# Altium schematic sheet modFOC-H_Bridges.SchDoc: modFOC-H-Bridges
size A4; Author: Mathias Giller; CompanyName: HTL St. Pölten; Address1: modFOC; DocumentNumber: 6; Revision: 2.0; SheetNumber: 6; SheetTotal: 7
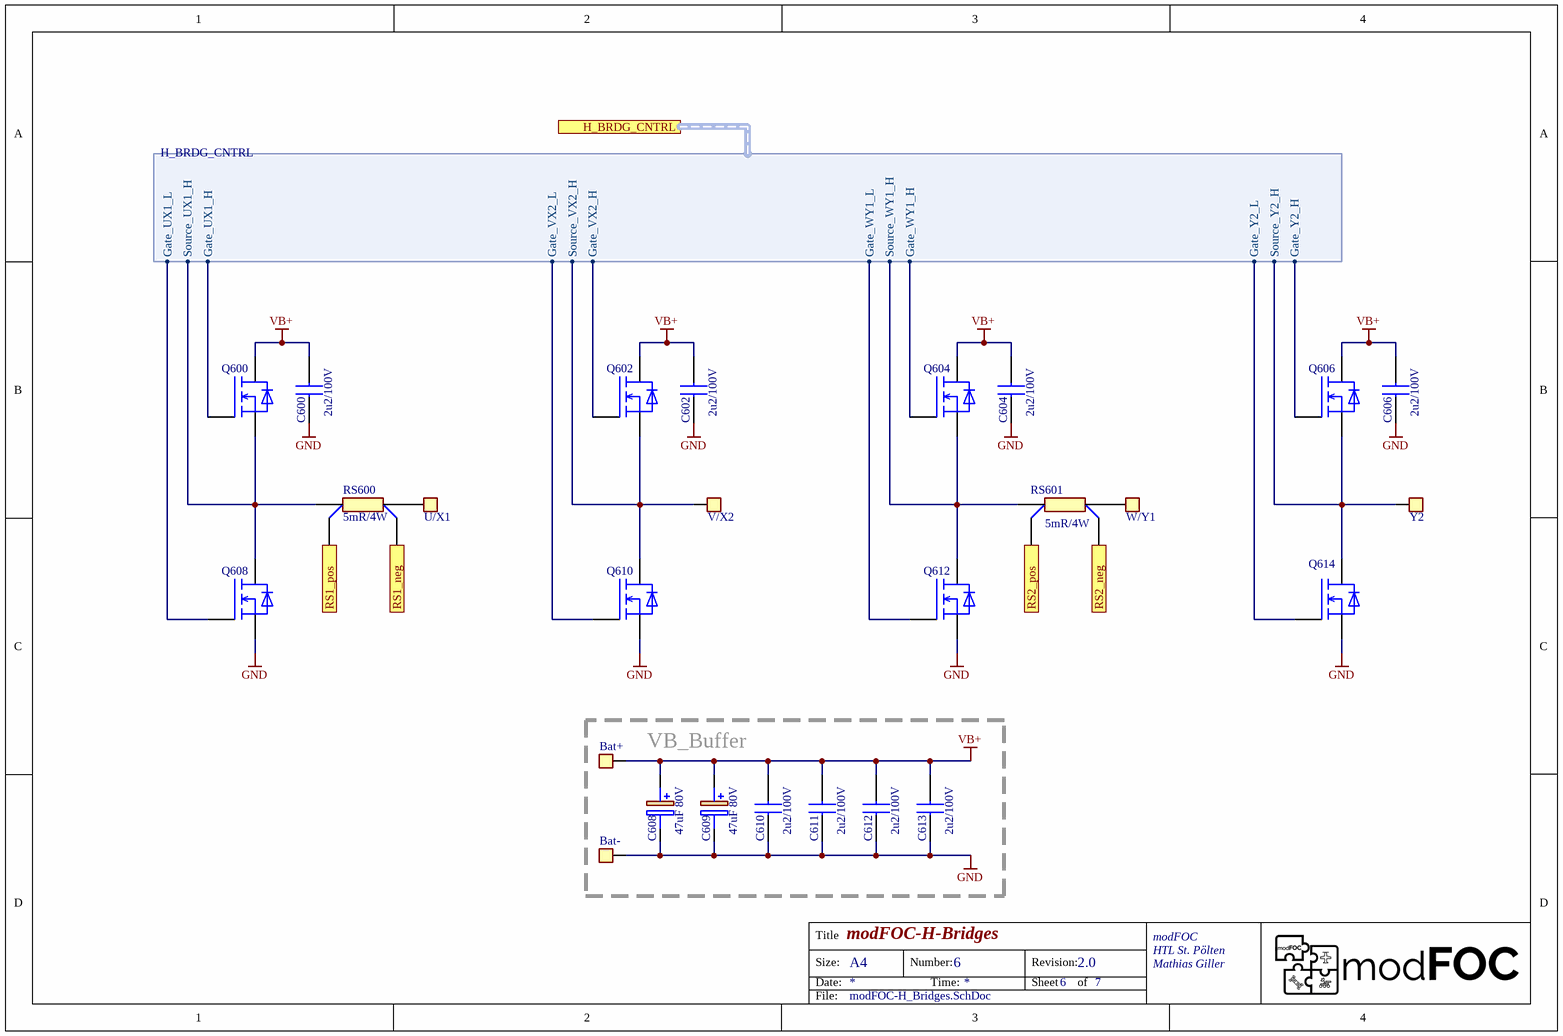
[diagram p0: modFOC-H_Bridges.SchDoc]

## Parts
Bat+  PowerPad  [POWER_PAD]  (value not drawn)
Bat-  PowerPad  [POWER_PAD]  (value not drawn)
C600  2u2/100V  [CAPC3225X280N]
C602  2u2/100V  [CAPC3225X280N]
C604  2u2/100V  [CAPC3225X280N]
C606  2u2/100V  [CAPC3225X280N]
C608  47uF 80V  [CAPAE1050X1050N]
C609  47uF 80V  [CAPAE1050X1050N]
C610  2u2/100V  [CAPC3225X280N]
C611  2u2/100V  [CAPC3225X280N]
C612  2u2/100V  [CAPC3225X280N]
C613  2u2/100V  [CAPC3225X280N]
Q600  80V/100A  [SI7141DPT1GE3]  (value not drawn)
Q602  80V/100A  [SI7141DPT1GE3]  (value not drawn)
Q604  80V/100A  [SI7141DPT1GE3]  (value not drawn)
Q606  80V/100A  [SI7141DPT1GE3]  (value not drawn)
Q608  80V/100A  [SI7141DPT1GE3]  (value not drawn)
Q610  80V/100A  [SI7141DPT1GE3]  (value not drawn)
Q612  80V/100A  [SI7141DPT1GE3]  (value not drawn)
Q614  80V/100A  [SI7141DPT1GE3]  (value not drawn)
RS600  5mR/4W  [FC4L90R025FER]
RS601  5mR/4W  [FC4L90R025FER]
U/X1  PowerPad  [POWER_PAD]  (value not drawn)
V/X2  PowerPad  [POWER_PAD]  (value not drawn)
W/Y1  PowerPad  [POWER_PAD]  (value not drawn)
Y2  PowerPad  [POWER_PAD]  (value not drawn)

## Blocks framed on the sheet
VB_Buffer: Bat+ Bat- C608-C613

## Ports
H_BRDG_CNTRL (harness H_BRDG_CNTRL), RS1_neg (out), RS1_pos (out), RS2_neg (out), RS2_pos (out)

## Harnesses
H_BRDG_CNTRL: Gate_UX1_H, Source_UX1_H, Gate_UX1_L, Source_VX2_H, Gate_VX2_H, Gate_VX2_L, Source_WY1_H, Gate_WY1_H, Gate_WY1_L, Source_Y2_H, Gate_Y2_H, Gate_Y2_L

## Nets
GND: Bat-.1 C600.1 C602.1 C604.1 C606.1 C608.2(-) C609.2(-) C610.1 C611.1 C612.1 C613.1 Q608.1,2,3(S) Q610.1,2,3(S) Q612.1,2,3(S) Q614.1,2,3(S)
VB+: Bat+.1 C600.2 C602.2 C604.2 C606.2 C608.1(+) C609.1(+) C610.2 C611.2 C612.2 C613.2 Q600.11,10,9,8,7,6,5(D) Q602.11,10,9,8,7,6,5(D) Q604.11,10,9,8,7,6,5(D) Q606.11,10,9,8,7,6,5(D)
RS1_neg: RS600.1(K1) ; port RS1_neg
RS1_pos: RS600.4(K2) ; port RS1_pos
RS2_neg: RS601.4(K2) ; port RS2_neg
RS2_pos: RS601.1(K1) ; port RS2_pos
NetQ600_1,2,3: Q600.1,2,3(S) Q608.11,10,9,8,7,6,5(D) RS600.3(P2) ; port H_BRDG_CNTRL.Source_UX1_H
NetQ600_4: Q600.4(G) ; port H_BRDG_CNTRL.Gate_UX1_H
NetQ602_1,2,3: Q602.1,2,3(S) Q610.11,10,9,8,7,6,5(D) V/X2.1 ; port H_BRDG_CNTRL.Source_VX2_H
NetQ602_4: Q602.4(G) ; port H_BRDG_CNTRL.Gate_VX2_H
NetQ604_1,2,3: Q604.1,2,3(S) Q612.11,10,9,8,7,6,5(D) RS601.2(P1) ; port H_BRDG_CNTRL.Source_WY1_H
NetQ604_4: Q604.4(G) ; port H_BRDG_CNTRL.Gate_WY1_H
NetQ606_1,2,3: Q606.1,2,3(S) Q614.11,10,9,8,7,6,5(D) Y2.1 ; port H_BRDG_CNTRL.Source_Y2_H
NetQ606_4: Q606.4(G) ; port H_BRDG_CNTRL.Gate_Y2_H
NetQ608_4: Q608.4(G) ; port H_BRDG_CNTRL.Gate_UX1_L
NetQ610_4: Q610.4(G) ; port H_BRDG_CNTRL.Gate_VX2_L
NetQ612_4: Q612.4(G) ; port H_BRDG_CNTRL.Gate_WY1_L
NetQ614_4: Q614.4(G) ; port H_BRDG_CNTRL.Gate_Y2_L
NetRS600_2: RS600.2(P1) U/X1.1
NetRS601_3: RS601.3(P2) W/Y1.1

## Notes on the sheet
- Title
- Size:
- Date:
- A4
- Number:
- Time:
- Revision:
- Sheet
- of
- File:

## Library data of the parts
C600 C602 C604 C606 C610-C613 = C1210: Capacitor
C608 C609 = MAL215097701E3: ELKO 10x10x10; Manufacturer_Name: Vishay; Datasheet Link: https://www.vishay.com/docs/28395/150crz.pdf; Height: 10.5mm; Manufacturer_Part_Number: MAL215097701E3; Mouser Part Number: 594-MAL215097701E3; Mouser Price/Stock: https://www.mouser.co.uk/ProductDetail/Vishay-BC-Components/MAL215097701E3?qs=bKenfurwlsnF8zBng3kToA%3D%3D
Q600 Q602 Q604 Q606 Q608 Q610 Q612 Q614 = SIR680DP-T1-RE3: MOSFET (N-Channel); Manufacturer_Name: Vishay; Datasheet Link: https://www.vishay.com/docs/75267/sir680dp.pdf; Height: 1.12mm; Manufacturer_Part_Number: SIR680DP-T1-RE3; Mouser Part Number: 78-SIR680DP-T1-RE3; Mouser Price/Stock: https://www.mouser.co.uk/ProductDetail/Vishay-Siliconix/SIR680DP-T1-RE3?qs=Mv7BduZupUi1ZFscSbHz5g%3D%3D; Arrow Part Number: SIR680DP-T1-RE3; Arrow Price/Stock: https://www.arrow.com/en/products/sir680dp-t1-re3/vishay
RS600 RS601 = FC4L90R025FER: Resistor; Manufacturer_Name: Ohmite; Datasheet Link: https://componentsearchengine.com/Datasheets/1/FC4L90R025FER.pdf; Height: 0.8mm; Manufacturer_Part_Number: FC4L90R025FER; Mouser Part Number: 588-FC4L90R025FER; Mouser Price/Stock: https://www.mouser.co.uk/ProductDetail/Ohmite/FC4L90R025FER?qs=lc2O%252BfHJPVauiFLZwCqH8Q%3D%3D